# EAGLE design led_tester_v2 (EAGLE 6.1)
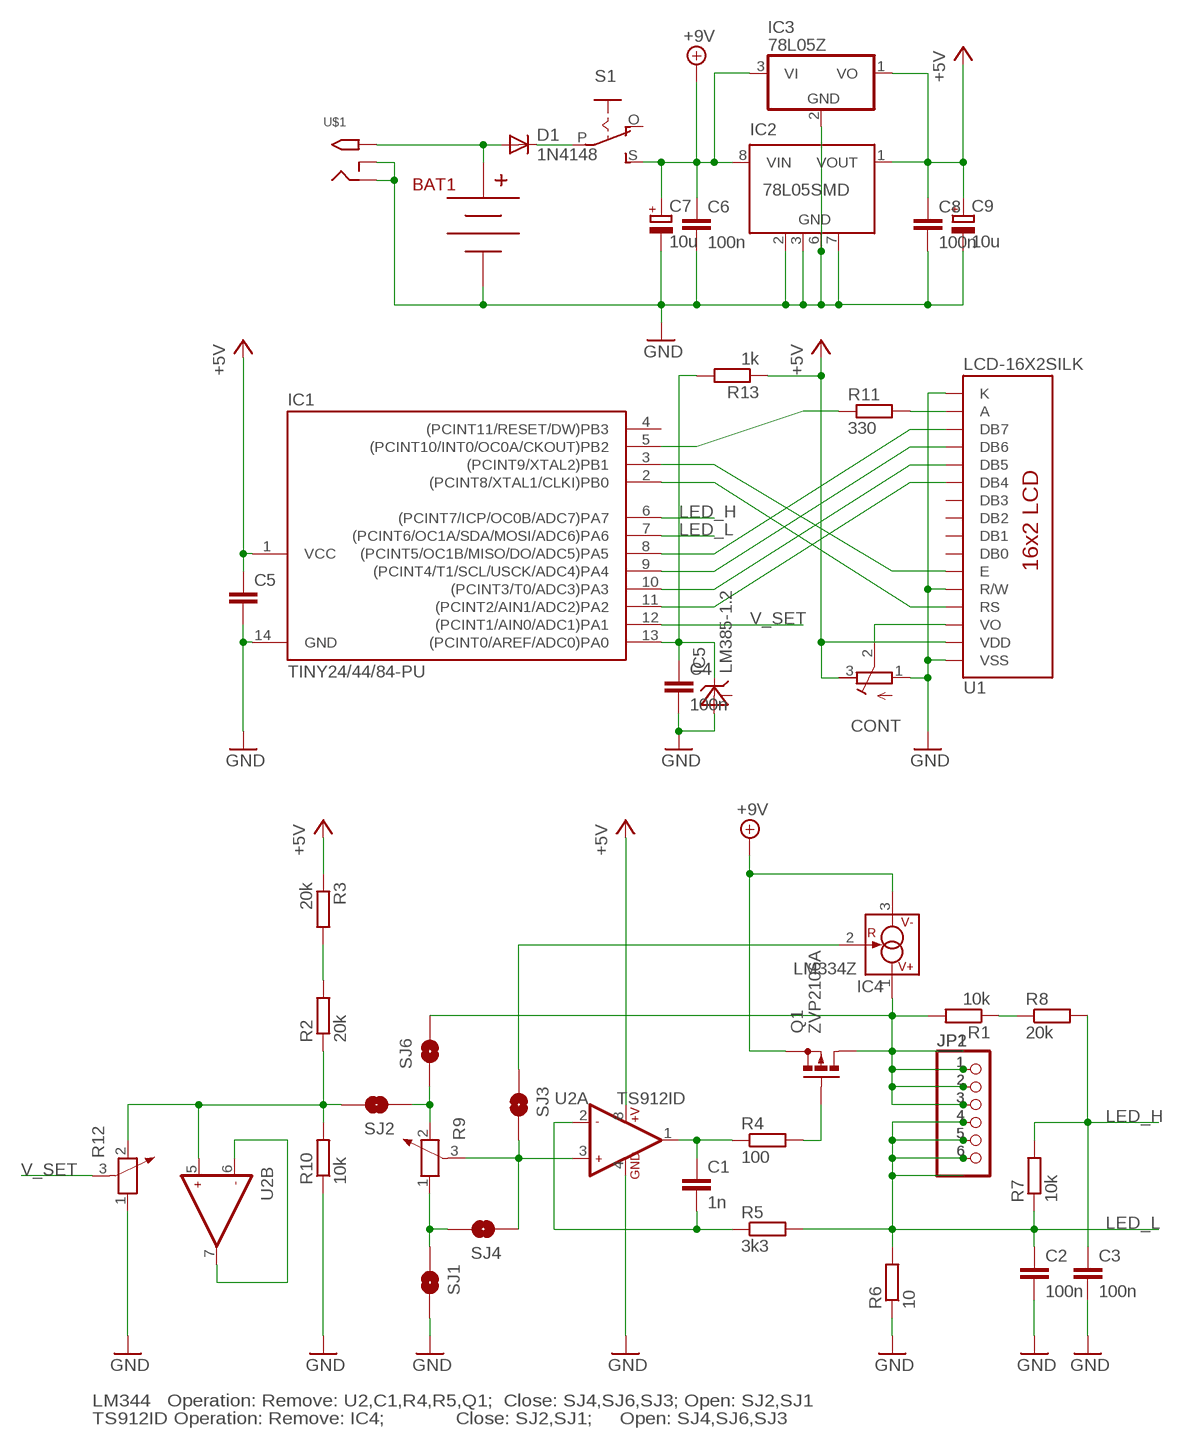
[diagram p0: schematic, sheet 1]

## Parts
BAT1  BC9VPCKIT_SOLDERMASK  [BC9VPC_KIT]
C1  1n  C-EU025-025X050  [C025-025X050]
C2  100n  C-EU025-025X050  [C025-025X050]
C3  100n  C-EU025-025X050  [C025-025X050]
C4  100n  C-EU025-025X050  [C025-025X050]
C5  C-EU025-025X050  [C025-025X050]
C6  100n  C-EU025-025X050  [C025-025X050]
C7  10u  CPOL-EUE2,5-6E  [E2,5-6E]
C8  100n  C-EU025-025X050  [C025-025X050]
C9  10u  CPOL-EUE2,5-6E  [E2,5-6E]
CONT  R-TRIMM3296P  [RTRIM3296P]
D1  1N4148  DIODE-D-10  [D-10]
IC1  TINY24/44/84-PU  [DIL14]
IC2  78L05SMD  [SO08]
IC3  78L05Z  [TO92]
IC4  LM334Z  [TO92]
IC5  LM385-1.2  [TO92-]
JP1  PINHD-1X6  [1X06]
JP2  PINHD-1X6  [1X06]
Q1  ZVP2106A  PFETZVP3306  [TO92-OVAL]
R1  10k  R-EU_0204/7  [0204/7]
R2  20k  R-EU_0204/7  [0204/7]
R3  20k  R-EU_0204/7  [0204/7]
R4  100  R-EU_0204/7  [0204/7]
R5  3k3  R-EU_0204/7  [0204/7]
R6  10  R-EU_0204/7  [0204/7]
R7  10k  R-EU_0204/7  [0204/7]
R8  20k  R-EU_0204/7  [0204/7]
R9  POTENTIOMETER_PT-10S  [PT-10S]
R10  10k  R-EU_0204/7  [0204/7]
R11  330  R-EU_0204/7  [0204/7]
R12  POTENTIOMETER_PT-10S  [PT-10S]
R13  1k  R-EU_0204/7  [0204/7]
S1  EG1218S  [EG1218]
SJ1  SOLDERJUMPERNO  [SJ_2S-NO]
SJ2  SOLDERJUMPERNO  [SJ_2S-NO]
SJ3  SOLDERJUMPERNO  [SJ_2S-NO]
SJ4  SOLDERJUMPERNO  [SJ_2S-NO]
SJ6  SOLDERJUMPERNO  [SJ_2S-NO]
U1  LCD-16X2SILK  [LCD-16X2]
U2  TS912ID  LMV358D  [SO08]
U$1  2.1MMJACKTHM  [PJ-102A]

## Nets
+5V: C5.1 C8.1 C9.+ CONT.3(E) IC1.1(VCC) IC2.1(VOUT) IC3.1(VO) R3.1 R13.1 U1.2(VDD) U2.8(A:+V)
+9V: C6.1 C7.+ IC2.8(VIN) IC3.3(VI) IC4.3(V-) Q1.1(S) S1.S
ANODE: IC4.1(V+) JP1.1 JP1.2 JP1.3 JP2.1 JP2.2 JP2.3 Q1.3(D) R1.2 SJ6.2
GND: BAT1.V+(V-) C2.2 C3.2 C4.2 C5.2 C6.2 C7.- C8.2 C9.- CONT.1(A) IC1.14(GND) IC2.2(GND) IC2.3(GND) IC2.6(GND) IC2.7(GND) IC3.2(GND) IC5.1(A) R6.1 R10.1 R12.1 SJ1.2 U1.1(VSS) U1.5(R/W) U1.16(K) U2.4(A:GND) U$1.RING U$1.RING_SW
LED_H: C3.1 IC1.6((PCINT7/ICP/OC0B/ADC7)PA7) R7.2 R8.2
LED_L: C2.1 IC1.7((PCINT6/OC1A/SDA/MOSI/ADC6)PA6) JP1.4 JP1.5 JP1.6 JP2.4 JP2.5 JP2.6 R5.2 R6.2 R7.1
N$1: IC1.8((PCINT5/OC1B/MISO/DO/ADC5)PA5) U1.14(DB7)
N$2: IC1.9((PCINT4/T1/SCL/USCK/ADC4)PA4) U1.13(DB6)
N$3: IC1.10((PCINT3/T0/ADC3)PA3) U1.12(DB5)
N$4: IC1.11((PCINT2/AIN1/ADC2)PA2) U1.11(DB4)
N$5: IC1.2((PCINT8/XTAL1/CLKI)PB0) U1.4(RS)
N$6: IC1.3((PCINT9/XTAL2)PB1) U1.6(E)
N$7: C1.1 R4.1 U2.1(A:OUT1)
N$8: Q1.2(G) R4.2
N$9: D1.C S1.P
N$10: R9.2 SJ2.1 SJ6.1
N$11: R2.1 R10.2 R12.2 SJ2.2 U2.5(B:+IN2)
N$12: C1.2 R5.1 U2.2(A:-IN1)
N$13: U2.6(B:-IN2) U2.7(B:OUT2)
N$14: R1.1 R8.1
N$15: CONT.2(S) U1.3(VO)
N$16: BAT1.V-(V+) D1.A U$1.TIP
N$17: R11.2 U1.15(A)
N$18: IC4.2(R) SJ3.1
N$19: R2.2 R3.2
N$20: IC1.5((PCINT10/INT0/OC0A/CKOUT)PB2) R11.1
N$22: R9.1 SJ1.1 SJ4.2
N$23: R9.3 SJ3.2 SJ4.1 U2.3(A:+IN1)
N$24: C4.1 IC1.13((PCINT0/AREF/ADC0)PA0) IC5.2(C) R13.2
V_SET: IC1.12((PCINT1/AIN0/ADC1)PA1) R12.3
Unconnected: IC1.4((PCINT11/RESET/DW)PB3) IC2.4(NC) IC2.5(NC) IC5.3(FB) S1.O U1.7(DB0) U1.8(DB1) U1.9(DB2) U1.10(DB3)

## Notes on the sheet
- LM344   Operation: Remove: U2,C1,R4,R5,Q1;  Close: SJ4,SJ6,SJ3; Open: SJ2,SJ1
- TS912ID Operation: Remove: IC4;             Close: SJ2,SJ1;     Open: SJ4,SJ6,SJ3

## Library data of the parts
BAT1 = _MY_OWN_LIB:BC9VPC: 9V board-mount battery cradle; PROD_ID: BATT-10855
C1-C6 C8 = rcl:C-EU: CAPACITOR, European symbol
C7 C9 = rcl:CPOL-EU: POLARIZED CAPACITOR, European symbol
CONT = rcl:R-TRIMM: Trimm resistor
D1 = diode:DIODE-: DIODE
IC1 = avr-5:TINY24/44/84
IC2 = linear:78L*SMD: Positive VOLTAGE REGULATOR
IC3 = linear:78*: Positive VOLTAGE REGULATOR Source: http://cache.national.com/ds/LM/LM78L05.pdf http://www.fairchildsemi.com/ds/LM/LM7805.pdf
IC4 = linear:LM*34: 3-Terminal Adjustable Current Sources Source: www.national.com/pf/LM/LM334.html | LM134.pdf
IC5 = oli:LM385*: LM185/285/385 Adjustable Micropower Voltage Reference Features Adjustable from 1.24 V to 5.30 V Operating current of 10 µA to 20 mA 1 % and 2 % initial tolerance 1 Ω dynamic impedance Low temperature coefficient
JP1 JP2 = pinhead:PINHD-1X6: PIN HEADER
Q1 = adafruit_t10:PFET: P-CHANNEL MOS FET
R1-R8 R10 R11 R13 = rcl:R-EU_: RESISTOR, European symbol
R9 R12 = rcl:POTENTIOMETER_: Potentiometer
S1 = _MY_OWN_LIB:EG1218: SLIDING SWITCH 0.1" spacing through hole, vertical SPDT slide switch http://www.ladyada.net/library/pcb/eaglelibrary.html
SJ1-SJ4 SJ6 = SparkFun-Retired:SOLDERJUMPER: Solder Jumper Standard SMD solder jumper. Used to automate production. Two varients : Normally Open and Normally Closed are the same, but have different paste layers. NC will have a large amount of paste and should jumper during reflow.
U1 = SparkFun-Displays:LCD-16X2: Standard text-only 16x2 parallel input LCD
U2 = IC:LMV358: General purpose LOW Voltage, Rail-to-Rail Output Amplifiers http://www.fairchildsemi.com/ds/LM/LMV358.pdf
U$1 = adafruit:2.1MMJACK: 2.1mm x 5.5mm THM DC jack with internal switch. Digikey part #PJ-102A, 4UCON part #05537 2.1mm x 5.5mm SMT DC jack with internal switch. Digikey part #PJ-002A-SMT, 4UCON part #03267 By microbuilder.eu & adafruit.com

## Board
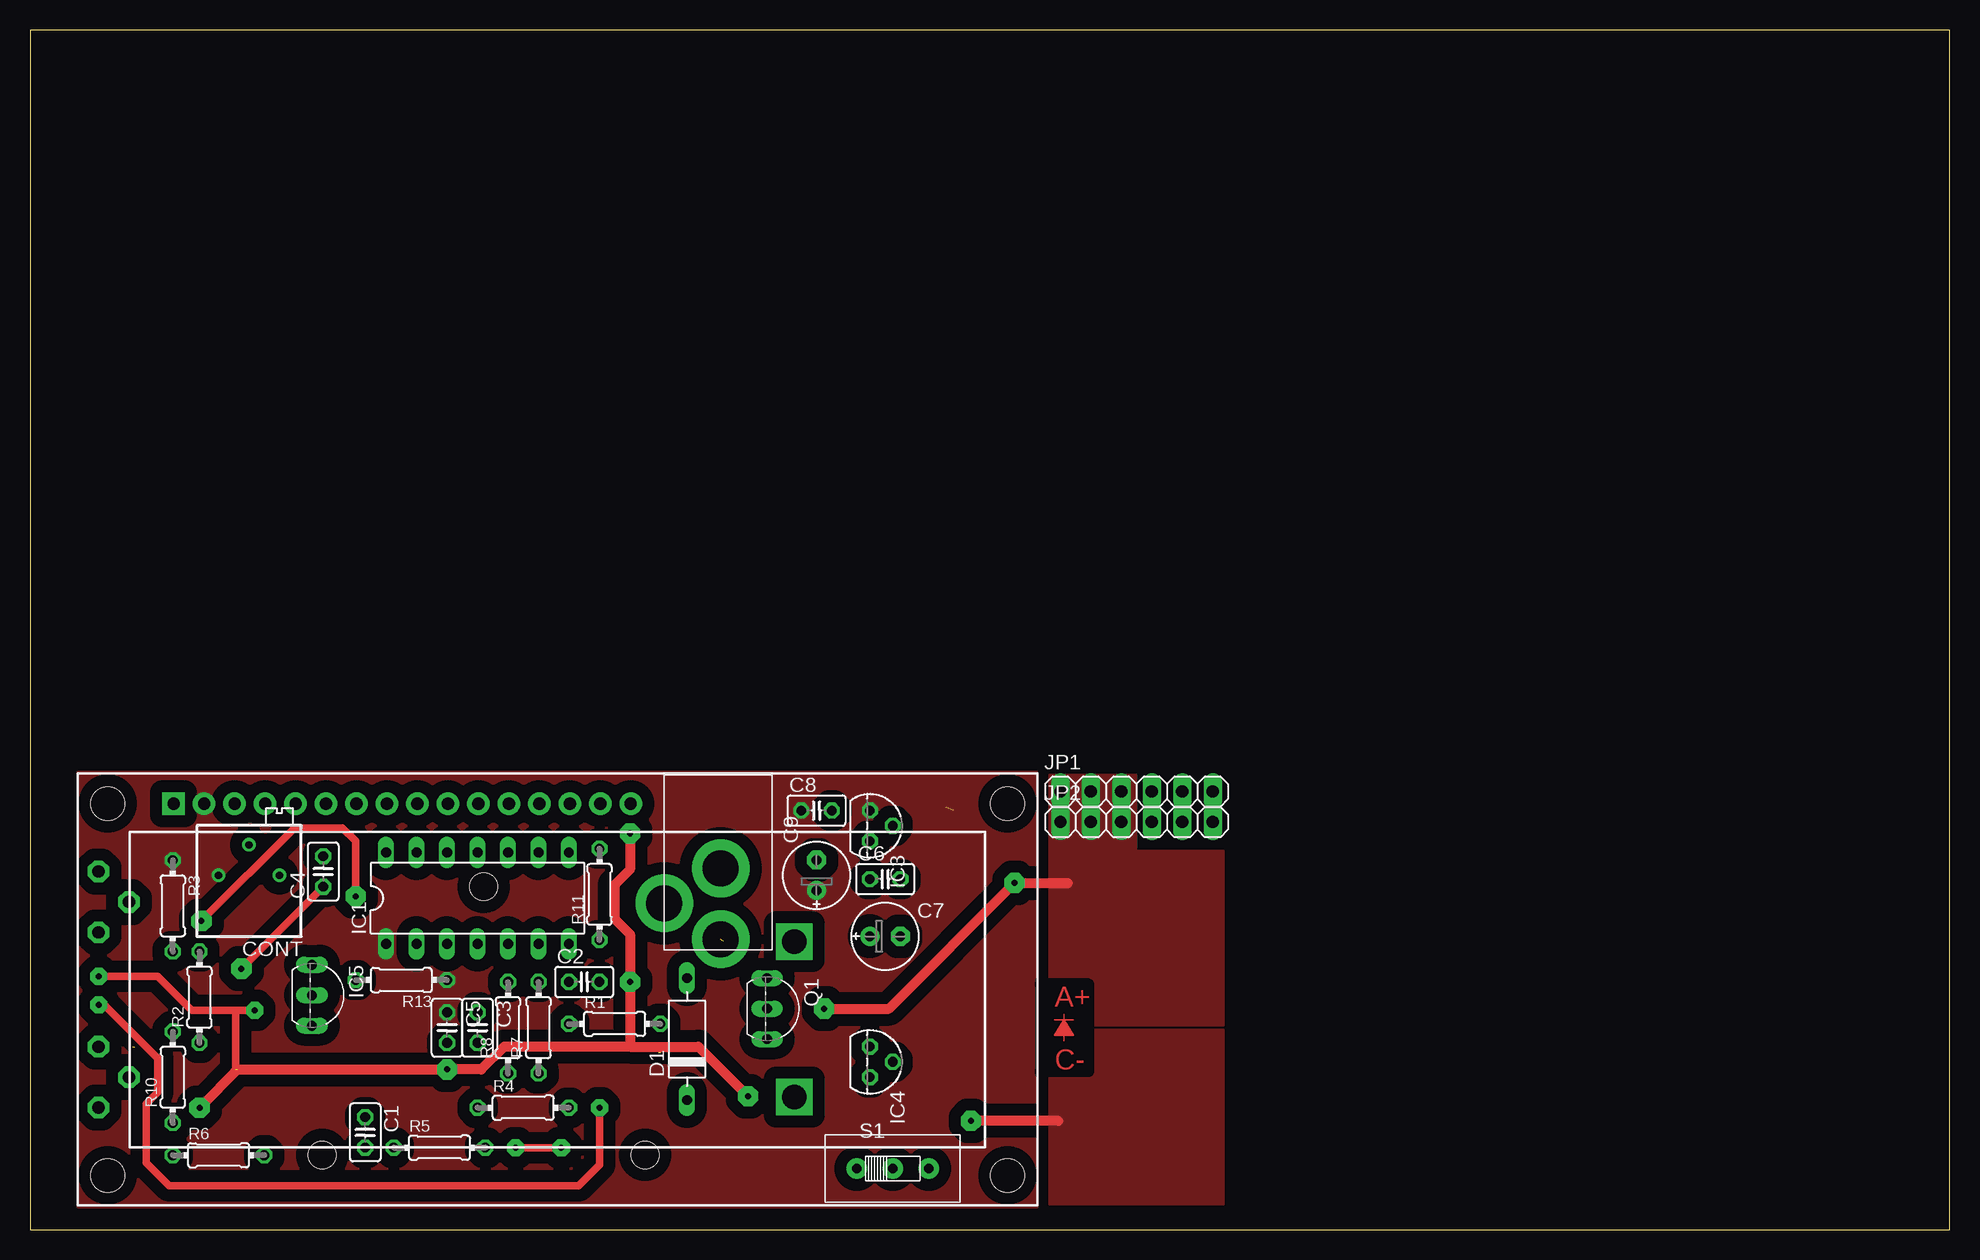
[diagram p1: board, top side]
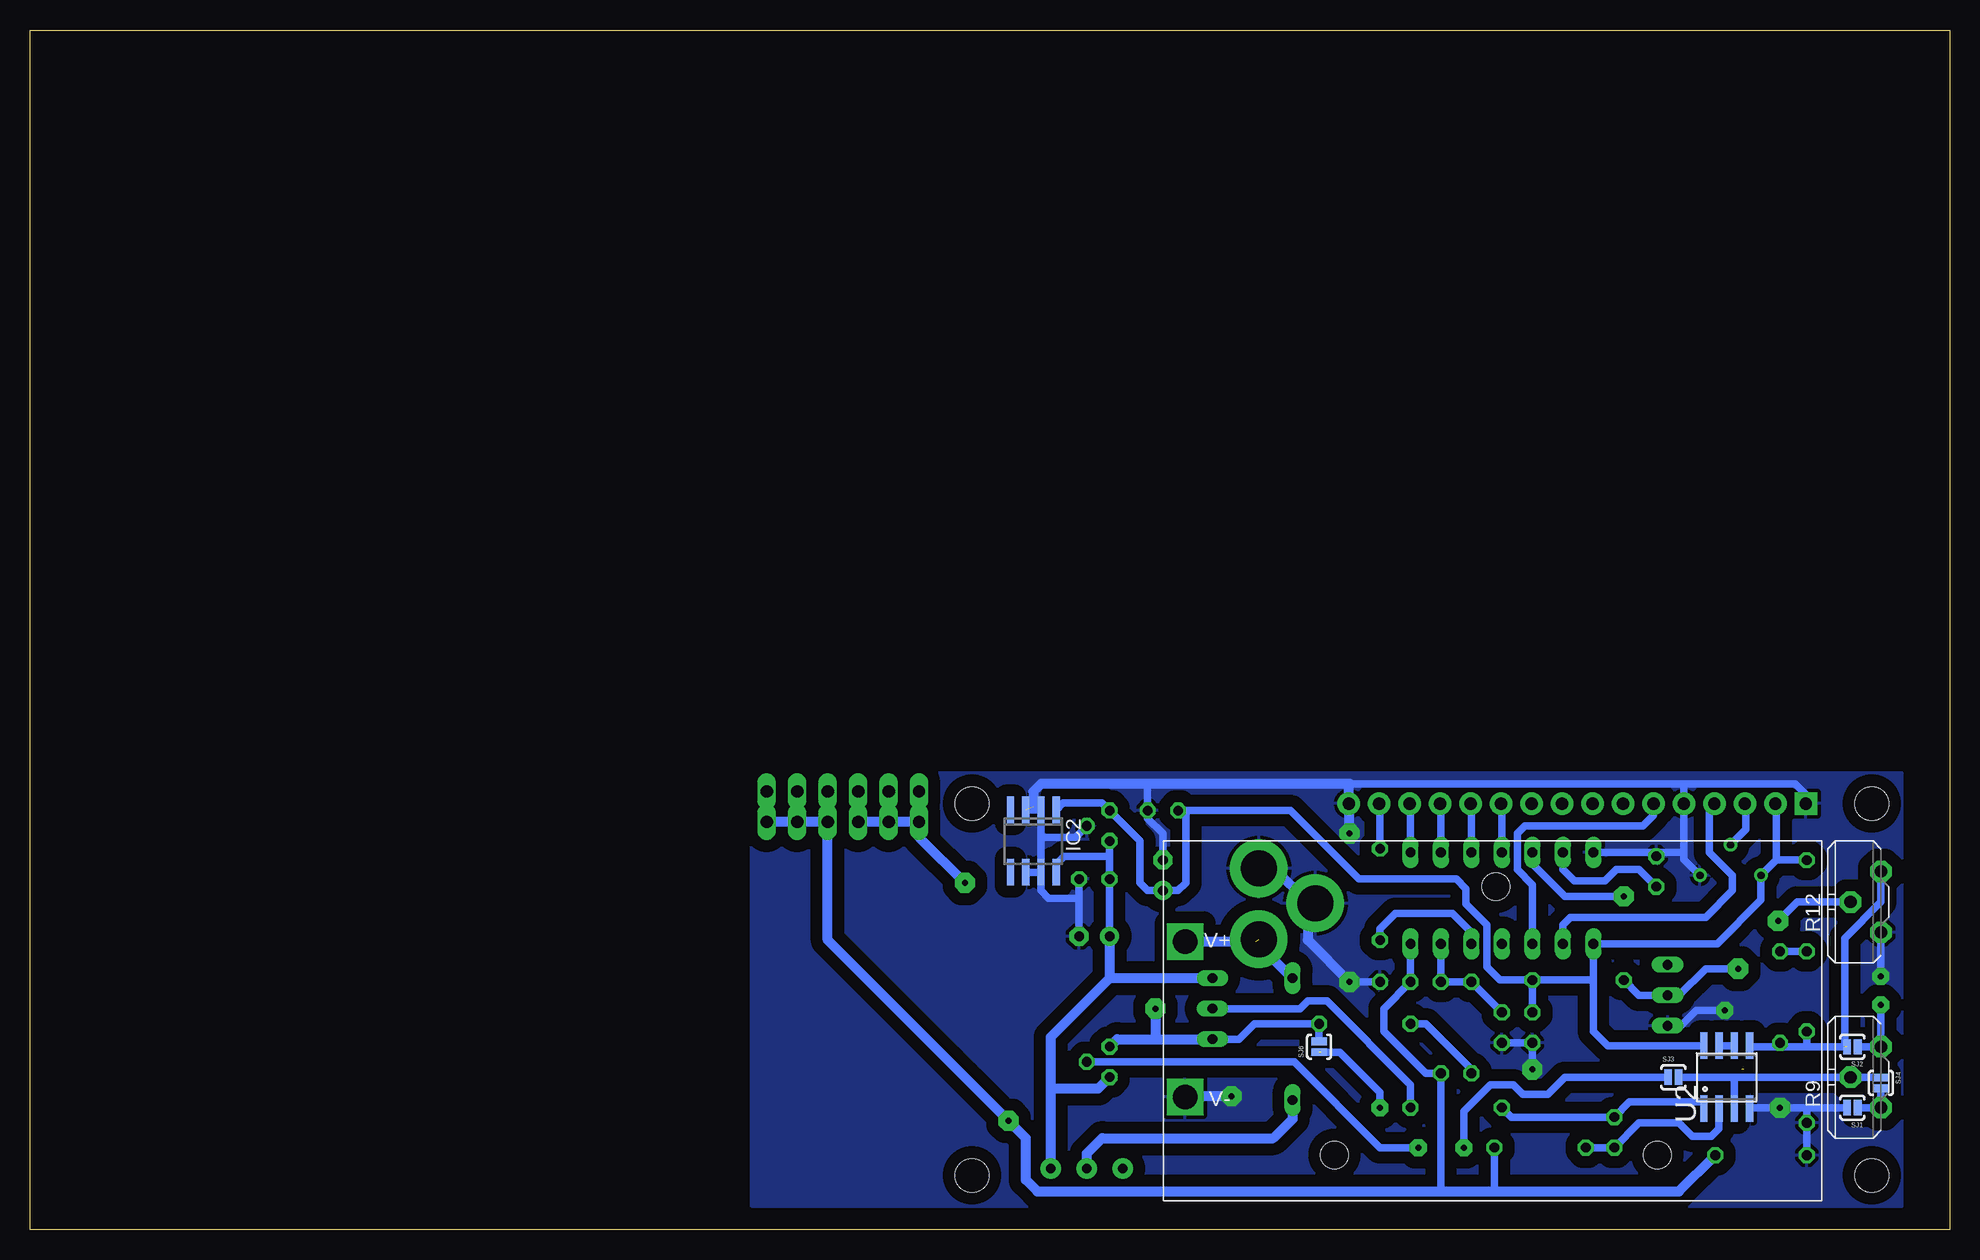
[diagram p2: board, bottom side, seen from below]

Size 160 x 100 mm. Coordinates in mm from the lower left corner, seen from the top.
Outline: 0,0 160,0 160,100 0,100 0,0
Copper layers (1*16): Top 0.035mm / dielectric 1.5mm / Bottom 0.035mm
Design rules: minimum track width 10mil, minimum drill 24mil, track to track 12mil, track to pad 12mil, pad to pad 12mil, via to via 12mil, smd to smd 10mil, copper to edge 12mil, drill to drill 12mil, minimum pad ring 10mil, minimum via ring 10mil, stop-mask expansion 4mil, vias tented up to drill 0mil, thermal gap 12mil
tRestrict: area 84.9,13.2 to 88.3,20.5

### Footprints (pad centres in the part's own frame; a part is rotated, then mirrored left to right if it is on the bottom)
BC9VPC_KIT = drill 2.032 square: V+ 53.086,21.336; V- 53.086,8.382 | hole 2.286: 27.178,3.81; 13.716,26.162; 40.64,26.162
C025-025X050 = drill 0.813 octagon: 1 -1.27,0; 2 1.27,0
E2,5-6E = drill 0.813 pad 1.575: + -1.27,0 | drill 0.813 pad 1.575 octagon: - 1.27,0
RTRIM3296P = drill 0.61: 1 0,-2.54; 2 2.54,0; 3 0,2.54
D-10 = drill 0.813 long: A 5.08,0; C -5.08,0
DIL14 = drill 0.813 long: 1 -7.62,-3.81; 2 -5.08,-3.81; 3 -2.54,-3.81; 4 0,-3.81; 5 2.54,-3.81; 6 5.08,-3.81; 7 7.62,-3.81; 8 7.62,3.81; 9 5.08,3.81; 10 2.54,3.81; 11 0,3.81; 12 -2.54,3.81; 13 -5.08,3.81; 14 -7.62,3.81
SO08 = smd 0.6 x 2.2: 1 -1.905,-2.6; 2 -0.635,-2.6; 3 0.635,-2.6; 4 1.905,-2.6; 5 1.905,2.6; 6 0.635,2.6; 7 -0.635,2.6; 8 -1.905,2.6
TO92 = drill 0.813 octagon: 1 -1.27,0; 2 0,1.905; 3 1.27,0
TO92- = drill 0.813 long: 1 2.54,0; 2 0,0; 3 -2.54,0
1X06 = drill 1.016 long: 1 -6.35,0; 2 -3.81,0; 3 -1.27,0; 4 1.27,0; 5 3.81,0; 6 6.35,0
TO92-OVAL = drill 0.813 long: 1 -2.54,0; 2 0,0; 3 2.54,0
0204/7 = drill 0.813 octagon: 1 -3.81,0; 2 3.81,0
PT-10S = drill 1.016 pad 1.778 octagon: 1 -2.54,-1.27; 2 2.54,-1.27; 3 0,1.27
EG1218 = drill 0.8 pad 1.676: O -3,0; P 0,0; S 3,0
SJ_2S-NO = smd 0.635 x 1.27: 1 -0.45,0; 2 0.45,0
LCD-16X2 = drill 1.016 pad 1.88 square: 1 -32,15.5 | drill 1.016 pad 1.88: 2 -29.46,15.5; 3 -26.92,15.5; 4 -24.38,15.5; 5 -21.84,15.5; 6 -19.3,15.5; 7 -16.76,15.5; 8 -14.22,15.5; 9 -11.68,15.5; 10 -9.14,15.5; 11 -6.6,15.5; 12 -4.06,15.5; 13 -1.52,15.5; 14 1.02,15.5; 15 3.56,15.5; 16 6.1,15.5 | hole 2.8: -37.5,15.5; -37.5,-15.5; 37.5,15.5; 37.5,-15.5
SO08' = smd 0.61 x 2.21: 1 -1.905,-2.616; 2 -0.635,-2.616; 3 0.635,-2.616; 4 1.905,-2.616; 5 1.905,2.616; 6 0.635,2.616; 7 -0.635,2.616; 8 -1.905,2.616
PJ-102A = drill 3 pad 4.8: RING 0.1,-3.39; RING_SW -4.6,-6.29; TIP 0.1,-9.29

### Placement (x,y rotation side)
BAT1  10.64,32.38 180 bottom
C1  27.94,8.1 270 top
C2  46.2,20.64 0 top
C3  37.31,16.83 270 top
C4  24.45,29.84 90 top
C5  34.77,16.83 270 top
C6  71.28,29.21 0 top
C7  71.28,24.45 0 top
C8  65.56,34.92 0 top
C9  65.56,29.53 90 top
CONT  18.26,29.53 90 top
D1  54.77,15.88 90 top
IC1  37.31,27.62 0 top
IC2  76.36,32.38 180 bottom
IC3  70.01,33.66 270 top
IC4  70.01,13.97 270 top
IC5  23.5,19.53 270 top
JP1  92.23,36.51 0 top
JP2  92.23,33.97 0 top
Q1  61.44,18.41 270 top
R1  48.74,17.14 0 top
R2  14.13,19.37 90 top
R3  11.91,26.99 270 top
R4  41.12,10.16 0 top
R5  34.13,6.83 0 top
R6  15.72,6.19 0 top
R7  42.39,16.83 90 top
R8  39.85,16.83 90 top
R9  6.99,12.7 90 bottom
R10  11.91,12.7 90 top
R11  47.47,27.94 90 top
R12  6.99,27.3 90 bottom
R13  30.96,20.8 180 top
S1  71.91,5.08 0 top
SJ1  8.1,10.16 180 bottom
SJ2  8.1,15.24 180 bottom
SJ3  23.02,12.7 0 bottom
SJ4  5.71,12.22 270 bottom
SJ6  52.55,15.24 90 bottom
U1  43.97,20 0 top
U2  TS912ID  [SO08']  18.57,12.7 0 bottom
U$1  57.47,33.5 0 top

### Tracks (layer width: path | path; a pad name or v marks a point on that pad's centre or on a via)
+5V
  Bottom 0.61: U1.2 14.45,35.44 14.45,30.8 | 29.69,20.8 IC1.1 19.37,23.81 15.72,27.46 CONT.3 14.45,30.8 | 29.69,20.8 R13.1 | R13.1 37.47,20.8 38.58,21.91 38.58,25.4 40.32,27.15 40.32,28.42 41.12,29.21 49.21,29.21 54.93,34.92 63.66,34.92 | C5.1 R13.1 | 29.69,20.8 29.69,16.51 28.49,15.32 U2.8 | C8.1 63.66,34.92 | 63.66,34.92 63.66,28.89 64.29,28.26 C9.+ 66.83,28.26 67.47,28.89 67.47,32.38 IC3.1 70.64,35.56 73.88,35.56 IC2.1 | R3.1 14.45,30.8
  pour Top (isolate 1.016, no thermals): 3.97,1.91 83.98,1.91 83.98,38.1 3.97,38.1
+9V
  Bottom 0.61: IC3.3 70.01,31.11 | 70.01,31.11 C6.1 C7.+ | IC2.8 74.45,30.48 73.82,31.11 70.01,31.11
  Bottom 0.813: Q1.1 70.01,20.95 | 70.01,20.95 74.91,16.05 74.91,11.75 | S1.S 74.91,11.75 | C7.+ 70.01,20.95 | 74.91,11.75 70.96,11.75 IC4.3
ANODE  (via drill 0.5 pad 1.68)
  Top 0.813: 86.52,28.89 v82.07,28.89 71.6,18.41 v66.2,18.41
  Bottom 0.61: JP1.1 86.04,36.51 86.04,33.97 | Q1.3 59.21,15.88 57.94,17.14 R1.2 SJ6.2
  Bottom 0.813: v82.07,28.89 85.88,32.7 JP2.1 JP1.1 | JP1.2 JP2.2 | JP2.3 JP1.3 | 86.04,33.97 91.12,33.97 | 61.28,15.88 Q1.3 66.2,15.88 | v66.2,18.41 66.2,15.88 | IC4.1 69.37,15.88 66.2,15.88
  pour Top (isolate 0.305, no thermals): 84.93,31.59 99.54,31.59 99.54,16.99 84.93,16.99
  pour Top (no thermals): 84.93,31.59 84.93,37.94 92.23,37.94 92.23,31.59
GND  (via drill 0.5 pad 1.42, 0.5 pad 1.68)  (2 unrouted)
  Top 0.61: 17.14,18.26 17.14,13.34 16.99,13.18 | v18.73,18.26 17.14,18.26 | v5.71,21.11 10.64,21.11 13.49,18.26 17.14,18.26
  Top 0.813: 50.01,15.24 39.53,15.24 37.62,13.34 v34.77,13.34 17.3,13.34 v14.13,10.16 | 50.01,15.24 v50.01,20.64 50.01,24.61 48.74,25.88 48.74,28.73 50.01,30 v50.01,33.02 | 50.01,15.24 55.72,15.24 v59.85,11.11
  Bottom 0.61: 22.07,37.15 12.86,37.15 11.91,36.2 11.91,35.56 | 22.07,37.15 50.01,37.15 | 22.07,37.15 22.13,37.08 U1.5 22.13,31.43 | IC1.14 24.45,31.43 | 24.45,31.43 22.13,31.43 | C3.2 C5.2 v34.77,13.34 | C2.2 v50.01,20.64 | IC2.3 IC2.2 75.72,32.7 | 66.83,37.15 C8.2 66.83,34.29 65.56,33.02 C9.- | IC3.2 72.87,32.7 75.72,32.7 | C6.2 72.55,27.62 | 72.55,27.62 75.09,27.62 75.72,28.26 IC2.7 IC2.6 75.78,29.79 75.72,29.84 75.72,32.7 | 72.55,27.62 C7.- | v5.71,21.11 5.71,23.97 | R6.1 R10.1 11.91,10.16 | 22.13,31.43 22.13,30.86 CONT.1 | SJ1.2 11.91,10.16 | 11.91,10.16 v14.13,10.16 16.51,10.16 16.59,10.08 U2.4 | C4.2 24.45,31.43 | v18.73,18.26 21.11,18.26 22.38,16.99 IC5.1
  Bottom 0.813: v59.85,11.11 63.66,11.11 BAT1.V+ | 50.07,36.9 U1.16 50.07,33.09 v50.01,33.02 | v50.01,20.64 53.5,24.13 53.5,27.3 56.36,30.16 57.94,30.16 | 50.01,37.15 66.83,37.15 75.72,37.15 76.36,36.51 76.36,35.24
  pour Bottom (isolate 1.016): 3.97,1.91 99.85,1.91 99.85,38.1 3.97,38.1
LED_H
  Bottom 0.61: IC1.6 R7.2 R8.2 C3.1
LED_L  (via drill 0.5 pad 1.68)
  Top 0.813: 85.72,9.05 v78.42,9.05
  Bottom 0.61: 42.39,3.17 R7.1 43.66,13.02 47.15,16.51 47.15,18.41 C2.1 IC1.7 | R5.2 37.94,3.17
  Bottom 0.813: JP2.4 93.5,24.13 v78.42,9.05 76.99,7.62 76.99,4.13 76.04,3.17 42.39,3.17 37.94,3.17 22.54,3.17 R6.2 | JP1.6 JP2.6 JP2.5 | JP1.4 JP2.4 | JP2.4 JP2.5 | JP1.5 JP2.5
  pour Top (isolate 0.305, no thermals): 84.93,16.67 99.54,16.67 99.54,2.06 84.93,2.06
N$1
  Bottom 0.61: IC1.8 44.93,35.44 U1.14
N$2
  Bottom 0.61: IC1.9 42.39,35.44 U1.13
N$3
  Bottom 0.61: IC1.10 39.85,35.44 U1.12
N$4
  Bottom 0.61: IC1.11 37.31,35.44 U1.11
N$5
  Bottom 0.61: IC1.2 32.23,25.4 31.59,26.04 20.32,26.04 18.1,28.26 18.1,29.53 20,31.43 20,34.92 19.59,35.33 U1.4
N$6
  Bottom 0.61: U1.6 24.67,34.54 25.56,33.66 35.4,33.66 36.04,33.02 36.04,30 34.77,28.73 IC1.3
N$7
  Bottom 0.61: U2.1 20.48,10.64 26.67,10.64 C1.1 36.51,9.37 R4.1
N$8
  Bottom 0.61: R4.2 44.93,12.06 51.91,19.05 53.5,19.05 54.13,18.41 Q1.2
N$9
  Bottom 0.813: S1.P 71.91,6.35 70.64,7.62 56.36,7.62 54.77,9.21 D1.C
N$10  (via drill 0.5 pad 1.42)  (1 unrouted)
  Top 0.61: v5.71,18.73 6.19,18.73 10.64,14.29 10.64,11.43 9.68,10.48 9.68,5.56 11.59,3.65 45.72,3.65 47.47,5.4 v47.47,10.16
  Bottom 0.61: SJ2.1 R9.2 v5.71,18.73 | 52.39,14.76 50.8,14.76 47.47,11.43 v47.47,10.16
N$11  (1 unrouted)
  Bottom 0.61: R10.2 11.91,15.24 | U2.5 16.67,15.24 14.13,15.24 R2.1 13.81,15.24 11.91,15.24 | 11.91,15.24 8.73,15.24 8.73,24.29 5.71,27.3 R12.2
N$12
  Bottom 0.61: U2.2 19.21,8.41 19.84,7.78 21.43,7.78 22.54,8.89 25.88,8.89 C1.2 R5.1
N$13
  Bottom 0.61: U2.6 U2.7
N$14
  Bottom 0.61: R1.1 43.66,17.14 39.85,13.34 R8.1
N$15
  Bottom 0.61: U1.3 16.99,35.44 16.99,33.34 CONT.2
N$16  (1 unrouted)
  Bottom 0.813: BAT1.V- 57.82,24 D1.A
N$17
  Bottom 0.61: R11.2 47.47,35.44 U1.15
N$18  (via drill 0.5 pad 1.42)
  Top 0.61: v44.29,6.83 v40.48,6.83
  Bottom 0.61: IC4.2 54.61,13.97 47.47,6.83 v44.29,6.83 | v40.48,6.83 40.48,9.84 38.26,12.06 36.35,12.06 35.56,11.27 33.5,11.27 32.07,12.7 SJ3.1
N$19
  Bottom 0.61: R2.2 R3.2
N$20
  Bottom 0.61: R11.1 47.47,25.08 46.2,26.35 41.43,26.35 39.85,24.77 IC1.5
N$21
  Top 0.127: 86.84,16.35 86.2,17.3 85.57,16.35 | 85.72,16.35 86.2,17.14 86.68,16.35 | 86.68,16.35 86.52,16.35 | 86.52,16.35 86.36,16.35 | 86.36,16.35 86.04,16.35 | 86.04,16.35 85.88,16.35 | 85.88,16.35 85.72,16.35 | 85.72,16.35 86.2,16.99 86.68,16.35 | 86.68,16.35 86.84,16.35 | 86.84,16.35 86.52,16.51 86.52,16.35 | 86.52,16.35 86.2,16.83 85.88,16.35 | 85.88,16.35 86.2,16.67 86.36,16.35 | 86.36,16.35 86.2,16.51 86.04,16.35 | 86.04,16.35 86.36,16.51 86.84,16.35 | 86.2,17.46 85.41,16.19 85.57,16.19 | 86.2,17.46 87,16.19 86.84,16.19 | 86.84,16.19 86.2,16.19 | 86.2,16.19 86.04,16.19 | 86.04,16.19 85.88,16.19 | 85.72,16.19 85.57,16.19 | 86.2,17.46 86.2,17.94 | 86.2,16.19 86.2,15.72 | 86.84,16.35 86.84,16.19 | 86.84,16.19 86.68,16.35 | 86.68,16.35 85.72,16.51 85.72,16.35 | 85.72,16.35 85.57,16.35 | 85.57,16.35 85.57,16.19 | 85.57,16.19 85.72,16.35 | 85.72,16.35 85.72,16.19 | 85.72,16.19 85.88,16.19 | 85.88,16.19 85.72,16.35 | 85.72,16.35 86.04,16.19 | 86.04,16.19 86.04,16.35 | 86.2,17.46 85.41,17.46 | 86.2,17.46 87,17.46
  Top 0.254: 86.68,16.35 86.04,16.35
N$22
  Bottom 0.61: SJ4.2 R9.1 SJ1.1
N$23
  Bottom 0.61: SJ4.1 8.23,12.67 R9.3 17.94,12.7 | 17.94,12.7 SJ3.2 | U2.3 17.94,12.7
N$24  (via drill 0.5 pad 1.68)
  Top 0.61: C4.1 v17.62,21.75
  Bottom 0.61: C4.1 25.88,30 27.78,30 28.73,29.05 31.27,29.05 32.23,30 IC1.13 | v17.62,21.75 20.32,21.75 22.54,19.53 IC5.2 25.88,19.53 R13.2
V_SET  (via drill 0.5 pad 1.68)
  Top 0.61: v27.15,27.78 27.15,32.38 26.04,33.5 22.07,33.5 v14.29,25.72
  Bottom 0.61: v14.29,25.72 12.7,27.3 R12.3 | v27.15,27.78 32.07,27.78 34.77,30.48 IC1.12

### Text on the board
Top: A+ | C-